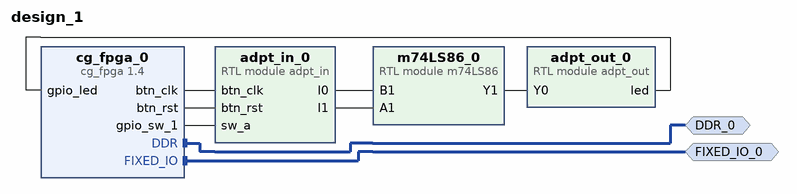
[diagram p0: block diagram of the top level]
# Vivado block design design_1, xc7z020clg400-1, Vivado 2025.2
create_bd_design design_1

create_bd_intf_port -mode Master -vlnv xilinx.com:display_processing_system7:fixedio_rtl:1.0 FIXED_IO_0
create_bd_intf_port -mode Master -vlnv xilinx.com:interface:ddrx_rtl:1.0 DDR_0

create_bd_cell -type ip -vlnv educg.net:user:cg_fpga:1.4 cg_fpga_0
create_bd_cell -type module -reference adpt_out adpt_out_0
create_bd_cell -type module -reference m74LS86 m74LS86_0
create_bd_cell -type module -reference adpt_in adpt_in_0

# ---- connections ----

connect_bd_intf_net [get_bd_intf_ports DDR_0] [get_bd_intf_pins cg_fpga_0/DDR]
connect_bd_intf_net [get_bd_intf_ports FIXED_IO_0] [get_bd_intf_pins cg_fpga_0/FIXED_IO]
connect_bd_net [get_bd_pins adpt_in_0/I0] [get_bd_pins m74LS86_0/B1]
connect_bd_net [get_bd_pins adpt_in_0/I1] [get_bd_pins m74LS86_0/A1]
connect_bd_net [get_bd_pins adpt_out_0/led] [get_bd_pins cg_fpga_0/gpio_led]
connect_bd_net [get_bd_pins cg_fpga_0/btn_clk] [get_bd_pins adpt_in_0/btn_clk]
connect_bd_net [get_bd_pins cg_fpga_0/btn_rst] [get_bd_pins adpt_in_0/btn_rst]
connect_bd_net [get_bd_pins cg_fpga_0/gpio_sw_1] [get_bd_pins adpt_in_0/sw_a]
connect_bd_net [get_bd_pins m74LS86_0/Y1] [get_bd_pins adpt_out_0/Y0]

validate_bd_design
save_bd_design
